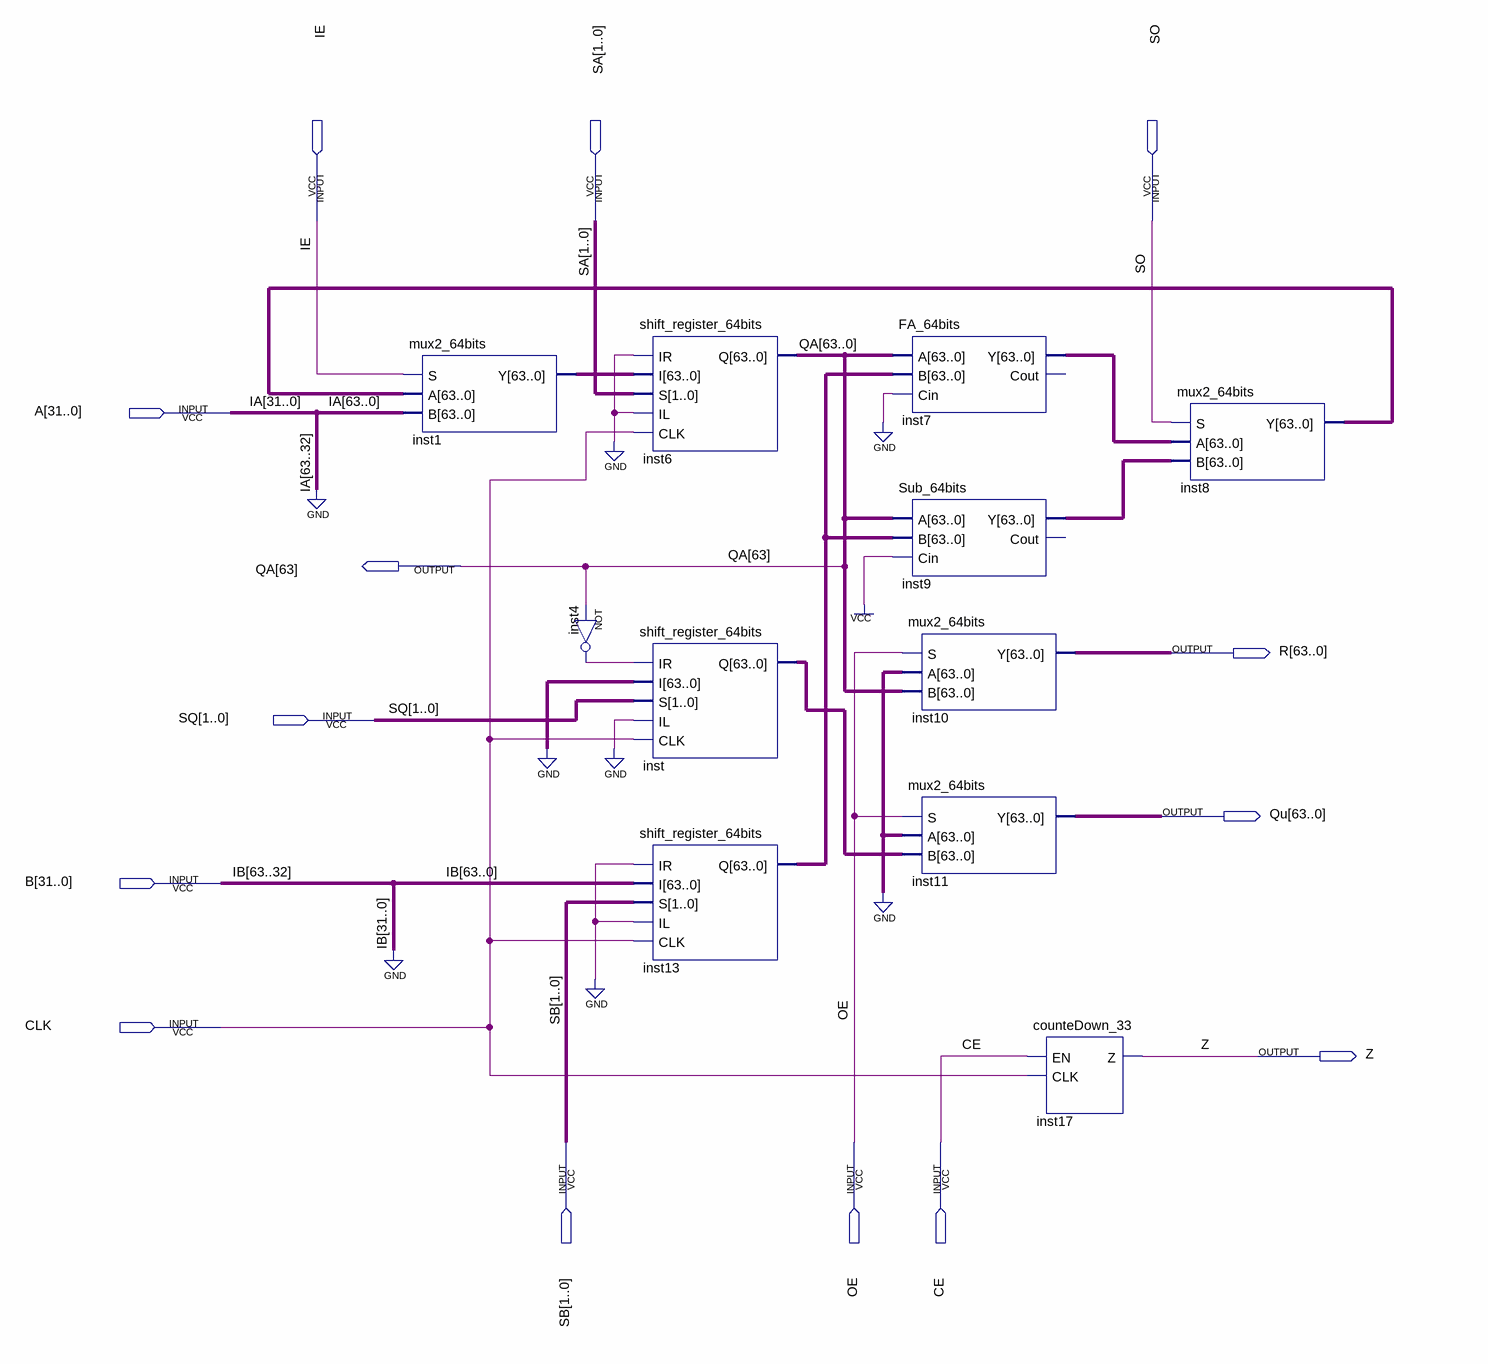
[diagram p0: schematic sheet]
// Quartus schematic datapath.bdf as structural Verilog: 11 symbols, 14 pins
module datapath (
  input  IE,
  input  [1:0] SA,
  input  SO,
  input  [31:0] A,
  input  [1:0] SQ,
  input  [31:0] B,
  input  CLK,
  input  [1:0] SB,
  input  OE,
  input  CE,
  output [63:0] QA,
  output [63:0] R,
  output [63:0] Qu,
  output Z
);

  wire inst4_out;
  wire [63:0] inst1_y, inst7_y, inst8_y, inst9_y, inst13_q, inst_q;

  mux2_64bits inst1 (.S(IE), .A(inst8_y), .B({{32{1'b0}}, A}), .Y(inst1_y));
  not inst4 (inst4_out, QA[63]);
  shift_register_64bits inst6 (.IR(1'b0), .I(inst1_y), .S(SA), .IL(1'b0), .CLK(CLK), .Q(QA));
  shift_register_64bits inst (.IR(inst4_out), .I({64{1'b0}}), .S(SQ), .IL(1'b0), .CLK(CLK), .Q(inst_q));
  shift_register_64bits inst13 (.IR(1'b0), .I({B, {32{1'b0}}}), .S(SB), .IL(1'b0), .CLK(CLK), .Q(inst13_q));
  FA_64bits inst7 (.A(QA), .B(inst13_q), .Cin(1'b0), .Y(inst7_y));  // open: Cout
  Sub_64bits inst9 (.A(QA), .B(inst13_q), .Cin(1'b1), .Y(inst9_y));  // open: Cout
  mux2_64bits inst10 (.S(OE), .A({64{1'b0}}), .B(QA), .Y(R));
  mux2_64bits inst11 (.S(OE), .A({64{1'b0}}), .B(inst_q), .Y(Qu));
  counteDown_33 inst17 (.EN(CE), .CLK(CLK), .Z(Z));
  mux2_64bits inst8 (.S(SO), .A(inst7_y), .B(inst9_y), .Y(inst8_y));

  // Other names for the same wires on the sheet: IA[31:0] = A; IB[63:32] = B
endmodule
